# EasyEDA Pro project ProProject_Access Control USB Adapter_2024-06-07.epro

# Schematic V2.0.1 Schematic
Create Date: 2024-05-29; Page Name: Main Page; Project Name: Access Control USB Adapter; Schematic Name: V2.0.1 Schematic; Update Date: 2024-05-29; Company: RIT SHED MAKERSPACE; Drawn: Jim Heaney; Page Size: A4; Part Number: JLCPCB-002; Reviewed: Jim Heaney; Version: V0.1
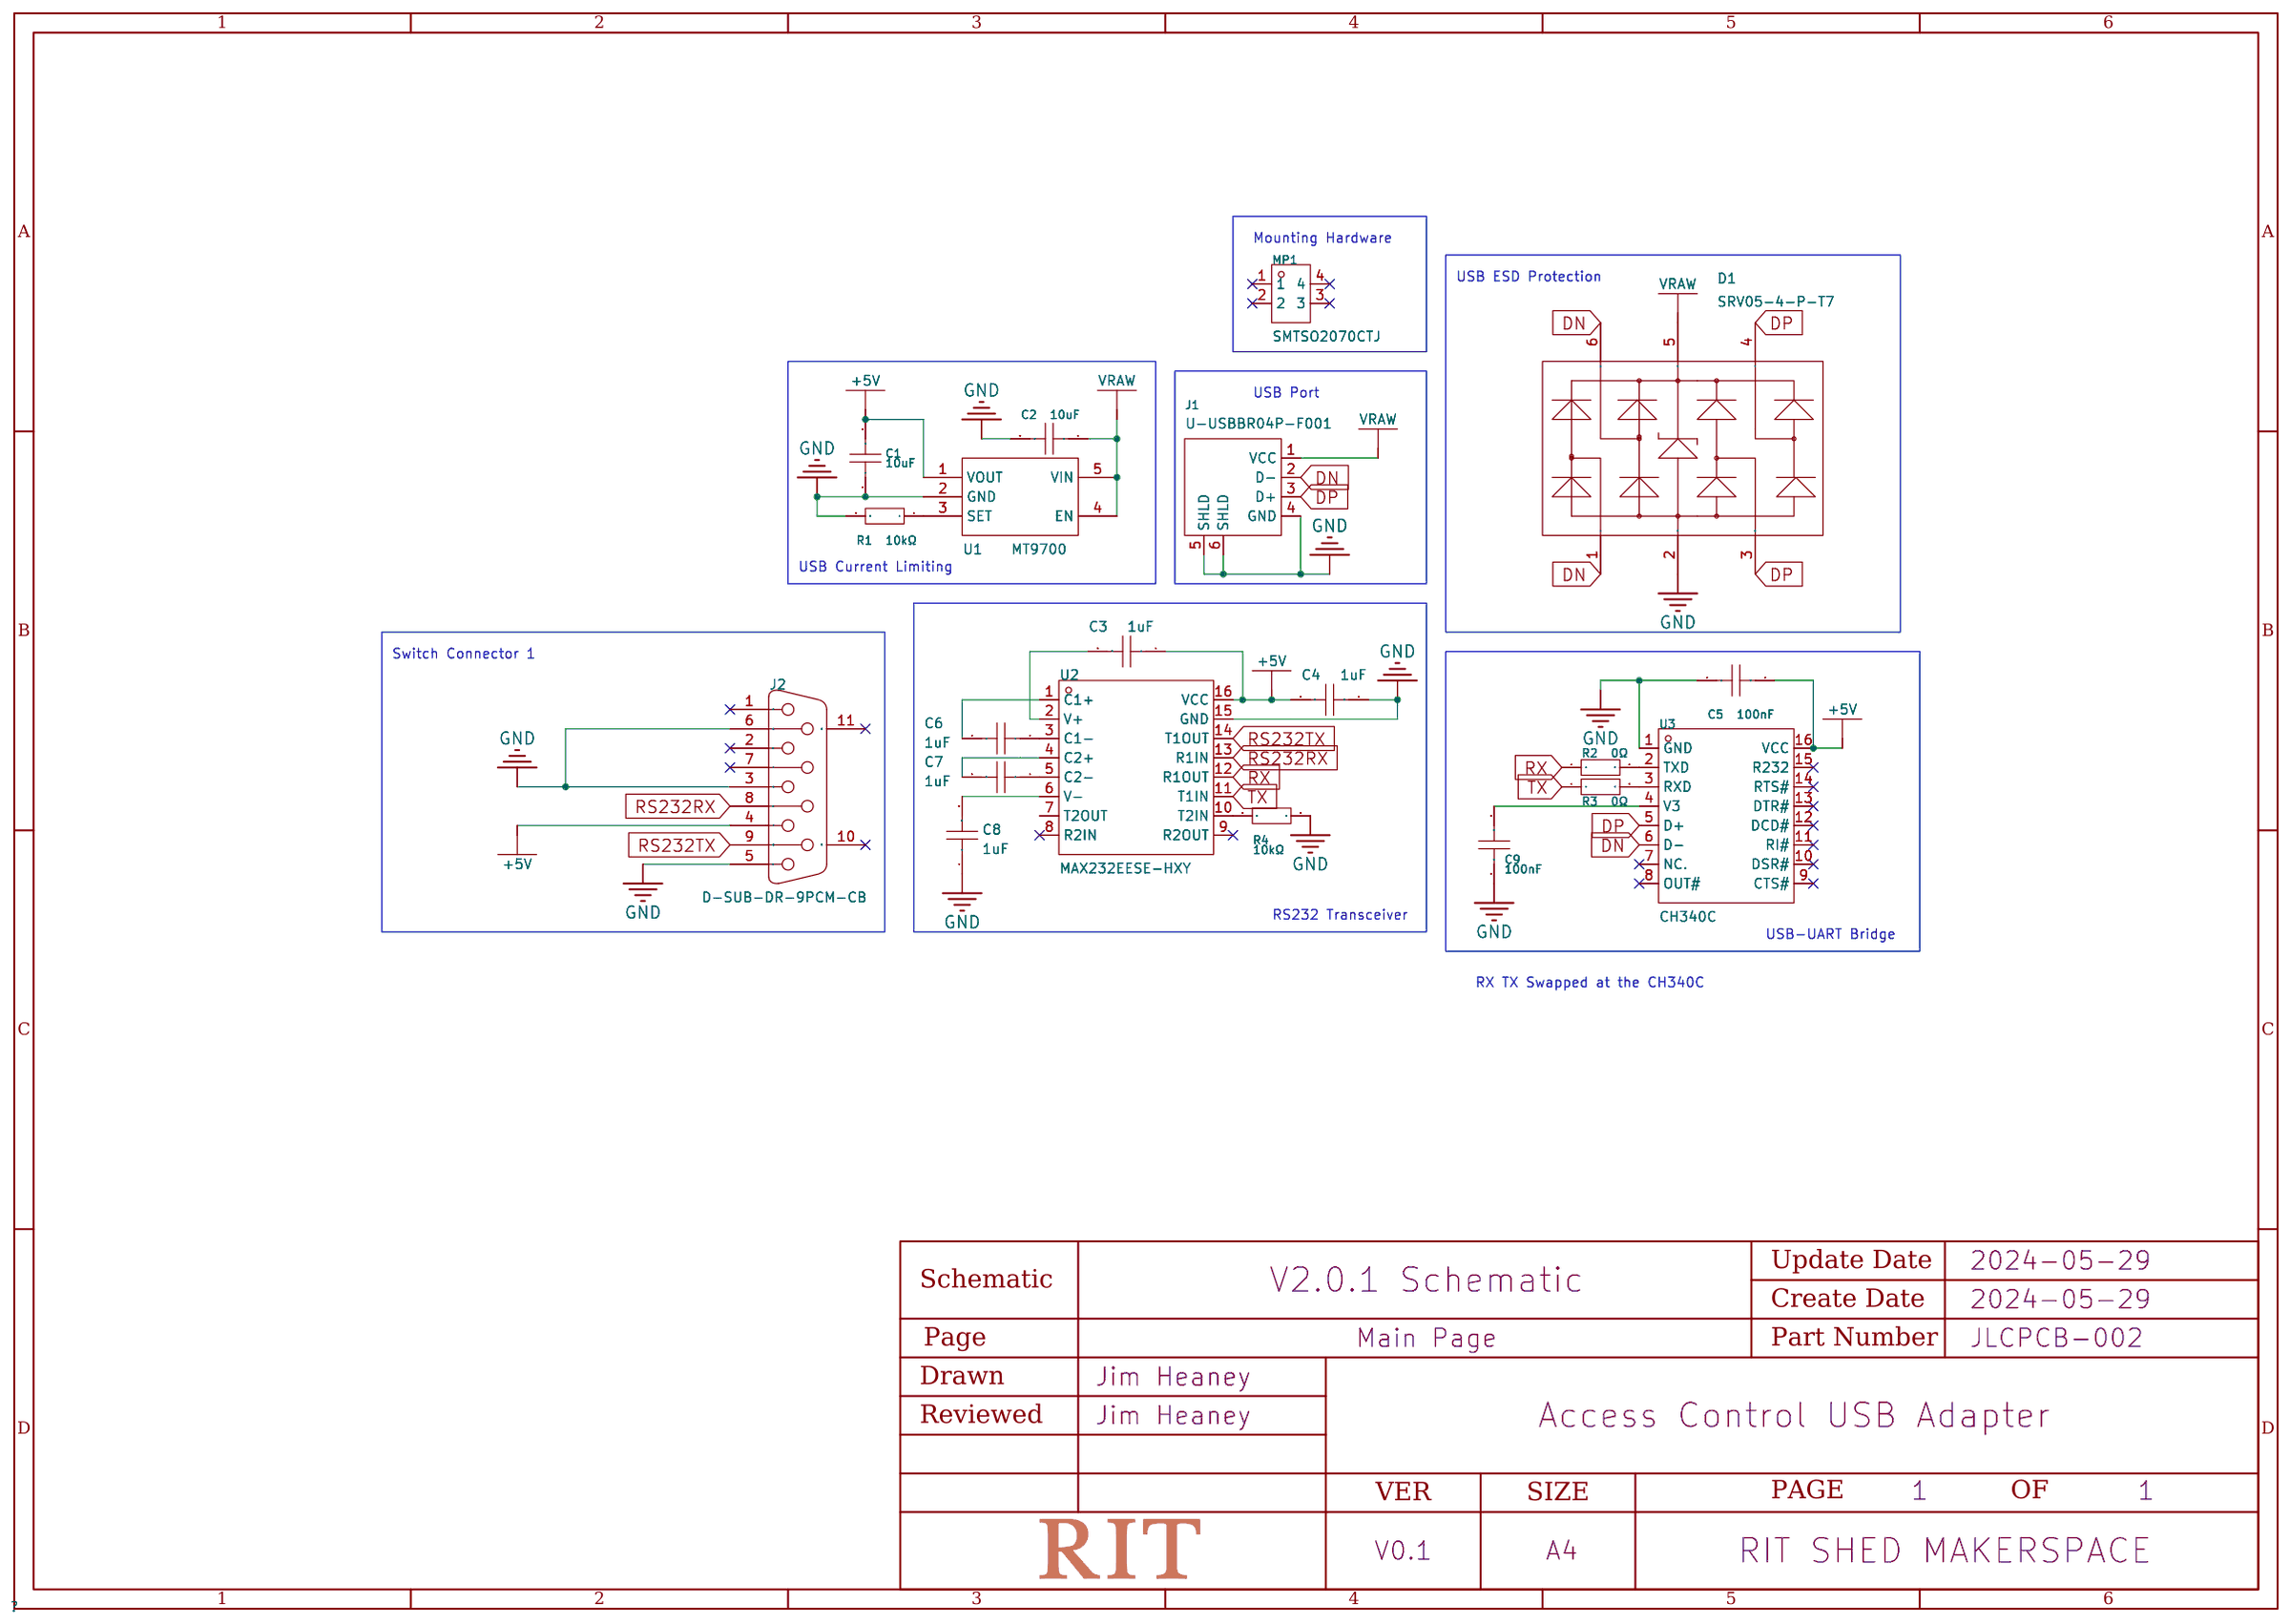
[diagram p0: schematic sheet]

## Parts
C1  10uF  [C0603]
C2  10uF  [C0603]
C3  1uF  [C0603]
C4  1uF  [C0603]
C5  100nF  [C0603]
C6  1uF  [C0603]
C7  1uF  [C0603]
C8  1uF  [C0603]
C9  100nF  [C0603]
D1  SRV05-4-P-T7  [SOT-23-6_L2.9-W1.6-P0.95-LS2.8-BR]
J1  U-USBBR04P-F001  [USB-B-TH_U241-041N-1BR85-1]
J2  D-SUB-DR-9PCM-CB  [DB9-TH_ID09S33E4GV00LF]
MP1  SMTSO2070CTJ  [SMD_BD5.6-L5.6-W5.6-D3.6]
R1  10kΩ  [R0603]
R2  0Ω  [R1206]
R3  0Ω  [R1206]
R4  10kΩ  [R0603]
U1  MT9700  [SOT-23-5_L3.0-W1.7-P0.95-LS2.8-BR]
U2  MAX232EESE-HXY  [SOP-16_L9.9-W3.9-P1.27-LS6.0-BL]
U3  CH340C  [SOP-16_L10.0-W3.9-P1.27-LS6.0-BL]

## Library data of the parts
C1 C2 = CL10A106MA8NRNC: Capacitance: Tolerance:±20% Tolerance:±20% Voltage Rated: Temperature Coefficient:; LCSC Part Name: 10uF ±20% 25V; Supplier Part: C96446; Manufacturer: SAMSUNG(三星); Supplier Footprint: 0603; JLCPCB Part Class: Basic Part; Datasheet: https://atta.szlcsc.com/upload/public/pdf/source/20160218/1457707763339.pdf; Supplier: LCSC; Tolerance: ±20%
C3 C4 C6-C8 = CL10A105KB8NNNC: Capacitance: Tolerance:±10% Tolerance:±10% Voltage Rated: Temperature Coefficient:; LCSC Part Name: 1uF ±10% 50V; Supplier Part: C15849; Manufacturer: SAMSUNG(三星); Supplier Footprint: 0603; JLCPCB Part Class: Basic Part; Datasheet: https://atta.szlcsc.com/upload/public/pdf/source/20160218/1457707763339.pdf; Supplier: LCSC; Tolerance: ±10%
C5 C9 = CC0603KRX7R9BB104: Capacitance: Tolerance:±10% Tolerance:±10% Voltage Rated: Temperature Coefficient:; LCSC Part Name: 100nF ±10% 50V; Supplier Part: C14663; Manufacturer: YAGEO(国巨); Supplier Footprint: 0603; JLCPCB Part Class: Basic Part; Datasheet: https://atta.szlcsc.com/upload/public/pdf/source/20180910/C282072_33301C7F631E79921B82A8DAC6BCC5B3.pdf; Supplier: LCSC; Tolerance: ±10%
D1 = SRV05-4-P-T7_C85364: Reverse Stand-Off Voltage (Vrwm):5V Breakdown Voltage:6V Peak Pulse Current (Ipp)@10/1000s:1A@8/20us Maximum Clamping Voltage:12V; LCSC Part Name: Vrwm:5V; Supplier Part: C85364; Manufacturer: PROTEK; Supplier Footprint: SOT-23-6; Datasheet: https://atta.szlcsc.com/upload/public/pdf/source/20161024/1477288764689.pdf; Supplier: LCSC; Reverse Stand-Off Voltage (Vrwm): 5V; Breakdown Voltage: 6V; Peak Pulse Current (Ipp)@10/1000μs: 1A@8/20us; Maximum Clamping Voltage: 12V
J1 = U-USBBR04P-F001: Connector Type:Type-B Standard:USB 2.0 Gender:Female Number of Ports:1 Number of Contacts:4P Mounting Style:Right-Angle Current Rating - Power (Max):1.5A Operating Temperature Range:- Operating Temperature Range:-; LCSC Part Name: Type-B 母 弯插; Supplier Part: C386743; Manufacturer: Ckmtw(灿科盟); Supplier Footprint: 插件; JLCPCB Part Class: Extended Part; Datasheet: https://atta.szlcsc.com/upload/public/pdf/source/20190509/C386743_2E7BDE199FB40B6F97679D15D491C286.pdf; Supplier: LCSC; Connector Type: Type-B; Standard: USB 2.0; Gender: Female; Number of Ports: 1; Number of Contacts: 4P; Mounting Style: Right-Angle; Current Rating - Power (Max): 1.5A
J2 = D-SUB-DR-9PCM-CB: Connector Type:D-Sub Gender:Female Number of Pins:9P Mounting Style:Right-Angle Number of Rows:2 Current Rating (Max):3A Contact Plating:Tin Operating Temperature Range:-50℃~+105℃ Operating Temperature Range:-50℃~+105℃; LCSC Part Name: D-Sub 母 P数:9P; Supplier Part: C19077337; Manufacturer: XUNPU(讯普); Supplier Footprint: 弯插; JLCPCB Part Class: Extended Part; Datasheet: https://atta.szlcsc.com/upload/public/pdf/source/20231108/FB2E8AB0BE4F620DDF3F7F4D0B9AFB97.pdf; Supplier: LCSC; Connector Type: D-Sub; Gender: Female; Number of Pins: 9P; Mounting Style: Right-Angle; Number of Rows: 2; Current Rating (Max): 3A; Contact Plating: Tin; Operating Temperature Range: -50℃~+105℃
MP1 = SMTSO2070CTJ: specifications:M2X7 surface treatment:镀锡 Product Description:- material quality:- model:SMTSO2070CTJ brand:Sinhoo(雄和远景); LCSC Part Name: 雄和远景，电路板表贴圆螺母柱，M2X7，铜镀锡,1个; Supplier Part: C2916355; Manufacturer: Sinhoo(雄和远景); JLCPCB Part Class: Extended Part; Datasheet: https://atta.szlcsc.com/upload/public/pdf/source/20211122/17CF5E24EB4D4DC090A80DE3D7DE5E21.pdf; Supplier: LCSC; specifications: M2X7; surface treatment: 镀锡; brand: Sinhoo(雄和远景)
R1 R4 = 0603WAF1002T5E: Type:Thick Film Resistors Resistance:10kΩ Tolerance:±1% Tolerance:±1% Power(Watts): Overload Voltage (Max): Temperature Coefficient:±100ppm/℃ Temperature Coefficient:±100ppm/℃ Operating Temperature Range:-55℃~+155℃ Operating Temperature Range:-55℃~+155℃; LCSC Part Name: 厚膜电阻 10kΩ ±1% 100mW; Supplier Part: C25804; Manufacturer: UNI-ROYAL(厚声); Supplier Footprint: 0603; JLCPCB Part Class: Basic Part; Datasheet: https://atta.szlcsc.com/upload/public/pdf/source/20200306/C422600_1E6D84923E4A46A82E41ADD87F860B5C.pdf; Supplier: LCSC; Type: Thick Film Resistors; Tolerance: ±1%; Temperature Coefficient: ±100ppm/℃; Operating Temperature Range: -55℃~+155℃
R2 R3 = 1206W4F0000T5E: Type:Thick Film Resistors Resistance: Tolerance:±1% Tolerance:±1% Power(Watts): Overload Voltage (Max): Temperature Coefficient:±800ppm/℃ Temperature Coefficient:±800ppm/℃ Operating Temperature Range:-55℃~+155℃ Operating Temperature Range:-55℃~+155℃; LCSC Part Name: 0Ω ±1% 250mW 厚膜电阻; Supplier Part: C17888; Manufacturer: UNI-ROYAL(厚声); Supplier Footprint: 1206; JLCPCB Part Class: Basic Part; Datasheet: https://atta.szlcsc.com/upload/public/pdf/source/20200306/C422600_1E6D84923E4A46A82E41ADD87F860B5C.pdf; Supplier: LCSC; Type: Thick Film Resistors; Tolerance: ±1%; Temperature Coefficient: ±800ppm/℃; Operating Temperature Range: -55℃~+155℃
U1 = MT9700: Supplier Part: C89855; Manufacturer: 西安航天民芯; Supplier Footprint: SOT-23-5; JLCPCB Part Class: Extended Part; Datasheet: https://atta.szlcsc.com/upload/public/pdf/source/20170418/1492481333031.pdf; Supplier: LCSC
U2 = MAX232EESE-HXY: Driver/receiver:2/2 Data Rate:120Kbps Data Rate:120Kbps Supply Voltage:5V Supply Voltage:5V; Supplier Part: C19626971; Manufacturer: HXY MOSFET(华轩阳电子); Supplier Footprint: SOP-16; JLCPCB Part Class: Extended Part; Datasheet: https://atta.szlcsc.com/upload/public/pdf/source/20231215/08C47B9710D348E23143C3CE5F7DFFF8.pdf; Supplier: LCSC; Driver/receiver: 2/2; Data Rate: 120Kbps; Supply Voltage: 5V
U3 = CH340C: Applications Function:Transceiver Protocol: Supply Voltage:3.3V；5V Supply Voltage:3.3V；5V Data Rate:2Mbps; LCSC Part Name: CH340C USB转串口芯片 CH340; Supplier Part: C84681; Manufacturer: WCH(南京沁恒); Supplier Footprint: SOP-16; JLCPCB Part Class: Extended Part; Datasheet: https://atta.szlcsc.com/upload/public/pdf/source/20200819/C84681_ADBED554CE321879DBD6B1D06488689C.pdf; Supplier: LCSC; Applications Function: Transceiver; Supply Voltage: 3.3V；5V; Data Rate: 2Mbps

## Nets
+5V: C1.2 C3.1 C4.2 C5.2 J2.4 U1.1(VOUT) U2.16(VCC) U3.16(VCC)
GND: C1.1 C2.2 C4.1 C5.1 C8.1 C9.1 D1.2 J1.4(GND) J1.5(SHLD) J1.6(SHLD) J2.3 J2.5 J2.6 R1.2 R4.1 U1.2(GND) U2.15(GND) U3.1(GND)
DN: D1.1 D1.6 J1.2(D-) U3.6(D-)
DP: D1.3 D1.4 J1.3(D+) U3.5(D+)
RS232RX: J2.8 U2.13(R1IN)
RS232TX: J2.9 U2.14(T1OUT)
RX: R2.1 U2.12(R1OUT)
TX: R3.1 U2.11(T1IN)
VRAW: C2.1 D1.5 J1.1(VCC) U1.4(EN) U1.5(VIN)
$1N403: C8.2 U2.6(V-)
$1N407: C7.1 U2.5(C2-)
$1N409: C3.2 U2.2(V+)
$1N413: C7.2 U2.4(C2+)
$1N417: C6.1 U2.3(C1-)
$1N419: C6.2 U2.1(C1+)
$1N493: R4.2 U2.10(T2IN)
$1N971: R1.1 U1.3(SET)
$1N1382: C9.2 U3.4(V3)
$1N1839: R2.2 U3.2(TXD)
$1N1841: R3.2 U3.3(RXD)

Not connected (* = marked no-connect by the designer): J2 1* 2* 7* 10(MH1)* 11(MH2)*; MP1 1* 2* 3* 4*; U2 7(T2OUT) 8(R2IN)* 9(R2OUT)*; U3 7(NC.)* 8(OUT#)* 9(CTS#)* 10(DSR#)* 11(RI#)* 12(DCD#)* 13(DTR#)* 14(RTS#)* 15(R232)*

## Notes on the sheet
- Mounting Hardware
- USB ESD Protection
- USB Port
- USB Current Limiting
- Switch Connector 1
- RS232 Transceiver
- USB-UART Bridge
- RX TX Swapped at the CH340C

# Board V2.0.1 PCB
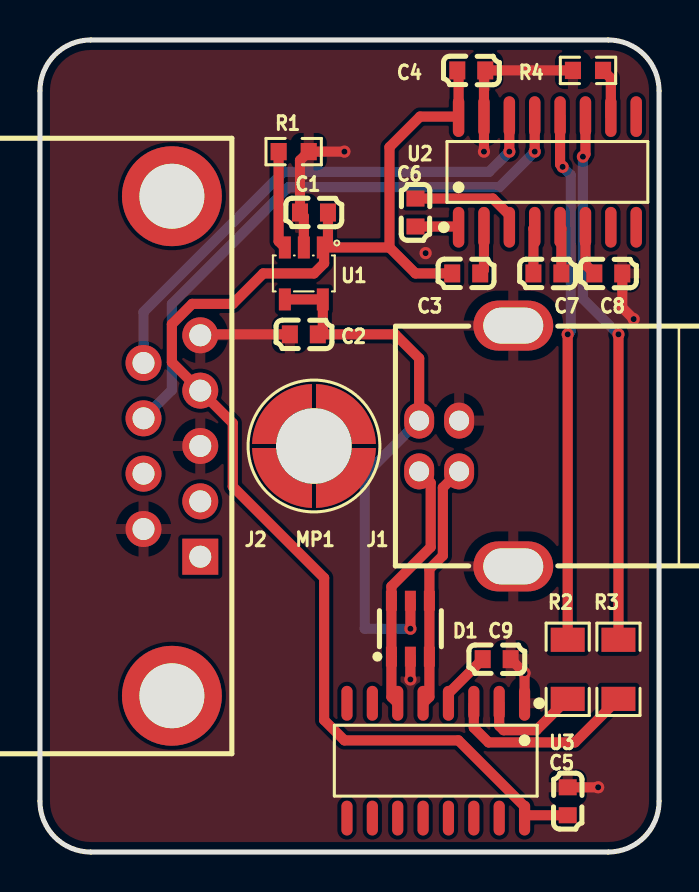
[diagram p1: board, top side]
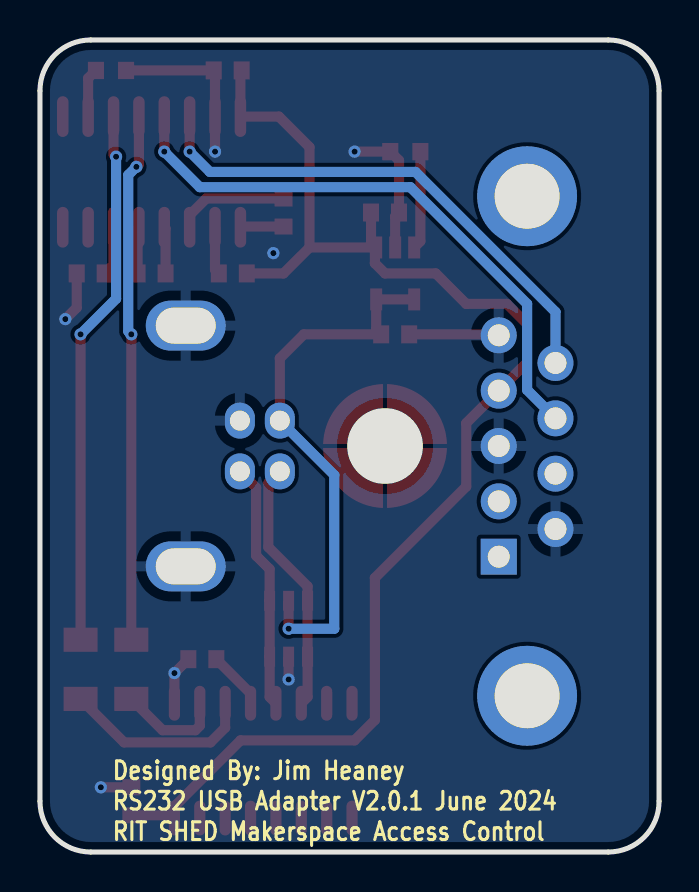
[diagram p2: board, bottom side, seen from below]

Outline 30.99 x 40.64 mm; copper layers: Top Layer, Bottom Layer. Coordinates in mm from the lower left corner of the outline.
Outline path: 0,38.1 0,2.54 arc(0.74,0.74) 2.54,0 28.45,0 arc(30.24,0.74) 30.99,2.54 30.99,38.1 arc(30.24,39.9) 28.45,40.64 2.54,40.64 arc(0.74,39.9) 0,38.1
Stack: Top Layer 0.035mm / Dielectric1 1.51mm FR4 er 4.5 / Bottom Layer 0.035mm

## Design rules (mm)
template: JLCPCB Capability(Two Layers Board)
spacing copperThickness1oz (default): track to track 0.102, other pairs 0.152 to 0.3
spacing copperThickness2oz: track to track 0.203, other pairs 0.152 to 0.3
track width copperThickness1oz (default): min 0.127, default 0.254, max 2.54
track width copperThickness2oz: min 0.203, default 0.254, max 2.54
differential pair differentialPair (default): width min 0.127, default 0.254, max 2.54; gap min 0.152, default 0.152
via viaSize (default): diameter min 0.5, default 0.61, max 10; hole min 0.3, default 0.305, max 6.3

## Placement (name value [footprint] x y rotation side)
C1  10uF  [C0603]  13.72 32 0 top
C2  10uF  [C0603]  13.21 25.91 180 top
C3  1uF  [C0603]  21.34 28.96 0 top
C4  1uF  [C0603]  21.59 39.12 180 top
C5  100nF  [C0603]  26.42 2.54 270 top
C6  1uF  [C0603]  18.8 32 270 top
C7  1uF  [C0603]  25.4 28.96 180 top
C8  1uF  [C0603]  28.45 28.96 180 top
C9  100nF  [C0603]  22.86 9.65 180 top
D1  SRV05-4-P-T7  [SOT-23-6_L2.9-W1.6-P0.95-LS2.8-BR]  18.54 11.18 270 top
J1  U-USBBR04P-F001  [USB-B-TH_U241-041N-1BR85-1]  21.34 20.32 90 top
J2  D-SUB-DR-9PCM-CB  [DB9-TH_ID09S33E4GV00LF]  6.6 20.32 270 top
MP1  SMTSO2070CTJ  [SMD_BD5.6-L5.6-W5.6-D3.6]  13.72 20.32 0 top
R1  10kΩ  [R0603]  12.7 35.05 0 top
R2  0Ω  [R1206]  26.42 9.14 270 top
R3  0Ω  [R1206]  28.96 9.14 270 top
R4  10kΩ  [R0603]  27.43 39.12 0 top
U1  MT9700  [SOT-23-5_L3.0-W1.7-P0.95-LS2.8-BR]  13.21 28.96 90 top
U2  MAX232EESE-HXY  [SOP-16_L9.9-W3.9-P1.27-LS6.0-BL]  25.4 34.04 0 top
U3  CH340C  [SOP-16_L10.0-W3.9-P1.27-LS6.0-BL]  19.81 4.57 180 top

## Footprints (pads in the part's own frame, mm; a bottom-side part is the same pattern mirrored in y, then rotated)
C0603
  rect 0.8x0.9 smd: 1(-0.7,0) 2(0.7,0)
DB9-TH_ID09S33E4GV00LF
  rect 1.8x1.8 hole 1.1: 1(5.54,1.42)
  round 1.8 hole 1.1: 2(2.77,1.42) 3(0,1.42) 4(-2.77,1.42) 5(-5.54,1.42) 6(4.155,-1.42) 7(1.385,-1.42) 8(-1.385,-1.42) 9(-4.155,-1.42)
  round 5 hole 3.25: 10(-12.5,0) 11(12.5,0)
R0603
  rect 0.806x0.864 smd: 1(-0.753,0) 2(0.753,0)
R1206
  rect 1.208x1.701 smd: 1(-1.479,0) 2(1.479,0)
SMD_BD5.6-L5.6-W5.6-D3.6
  custom 3x3 smd: 1(-1.844,1.6) 1(-1.601,-1.844) 1(1.6,1.844) 1(1.844,-1.6)
SOP-16_L9.9-W3.9-P1.27-LS6.0-BL
  oval 0.574x2.038 smd: 1(-4.445,-2.769) 2(-3.175,-2.769) 3(-1.905,-2.769) 4(-0.635,-2.769) 5(0.635,-2.769) 6(1.905,-2.769) 7(3.175,-2.769) 8(4.445,-2.769) 9(4.445,2.769) 10(3.175,2.769) 11(1.905,2.769) 12(0.635,2.769) 13(-0.635,2.769) 14(-1.905,2.769) 15(-3.175,2.769) 16(-4.445,2.769)
SOP-16_L10.0-W3.9-P1.27-LS6.0-BL
  oval 0.56x1.745 smd: 1(-4.445,-2.873) 2(-3.175,-2.873) 3(-1.905,-2.873) 4(-0.635,-2.873) 5(0.635,-2.873) 6(1.905,-2.873) 7(3.175,-2.873) 8(4.445,-2.873) 9(4.445,2.873) 10(3.175,2.873) 11(1.905,2.873) 12(0.635,2.873) 13(-0.635,2.873) 14(-1.905,2.873) 15(-3.175,2.873) 16(-4.445,2.873)
SOT-23-5_L3.0-W1.7-P0.95-LS2.8-BR
  rect 1.1x0.6 smd: 1(1.3,-0.95) 2(1.3,0) 3(1.3,0.95) 4(-1.3,0.95) 5(-1.3,-0.95)
SOT-23-6_L2.9-W1.6-P0.95-LS2.8-BR
  rect 1x0.55 smd: 1(1.4,-0.95) 2(1.4,0) 3(1.4,0.95) 4(-1.4,0.95) 5(-1.4,0) 6(-1.4,-0.95)
USB-B-TH_U241-041N-1BR85-1
  oval 1.8x1.5 hole 1: 1(1.27,2.355) 2(-1.27,2.355) 3(-1.27,0.355) 4(1.27,0.355)
  oval 2.5x4 hole 1.8x3: 5(6.025,-2.355) 6(-6.025,-2.355)

## Nets
As in the schematic.

Pads without a net: J2 1 2 7 10 11; MP1 1; U2 7 8 9; U3 7 8 9 10 11 12 13 14 15

## Via types
v1: diameter 0.61, hole 0.305, Top Layer to Bottom Layer, 14 vias

## Routing (per net, layer and track width the routed paths; a pad name or vN(x,y) marks a point on that pad's centre or on a via; arc(x,y) is an arc through that point)
+5V: length 67.6
  Top Layer w0.508: U1.1 14.22,30.19 14.22,29.46 13.72,28.96 11.18,28.96 9.65,27.43 7.62,27.43 6.6,26.42 6.6,24.51 J2.4 9.65,21.46 9.65,18.29 14.22,13.72 14.22,6.6 15.24,5.59 20.95,5.59 24.26,2.28 U3.16 24.4,1.84 C5.2 ; U1.1 17.5,30.26 ; U1.1 14.42,30.51 C1.2 ; C4.2 20.95,39.05 20.95,36.8 19.02,36.8 17.5,35.28 17.5,30.26 ; 17.5,30.26 18.8,28.96 C3.1
GND: length 27.5
  Top Layer w0.508: C2.2 8.07,25.91 J2.5 ; C9.1 v1(24.26,8.95) U3.1 ; R4.1 C4.1 22.22,39.05 v1(22.22,35.05) ; C5.1 v1(27.94,3.24) ; v1(29.72,26.67) 29.15,27.24 C8.1 ; v1(15.24,35.05) R1.2 13.02,34.61 C1.1 13.21,31.81 U1.2 ; v1(18.54,8.64) D1.2
  vias: v1(19.3,29.97)
DN: length 12.8
  Top Layer w0.508: U3.6 17.59,7.76 D1.1 D1.6 17.59,13.29 19.56,15.26 19.56,18.47 J1.2
DP: length 12.4
  Top Layer w0.508: U3.5 19.49,7.76 D1.3 D1.4 19.49,14.16 20.17,14.83 20.17,18.24 J1.3
RS232RX: length 28.8
  Top Layer w0.508: 24.76,36.8 v1(24.76,35.05)
  Bottom Layer w0.508: 5.62,22.14 6.6,23.12 6.6,27.43 12.45,33.27 22.99,33.27 v1(24.76,35.05)
RS232TX: length 25.9
  Top Layer w0.508: 23.5,36.8 v1(23.5,35.05)
  Bottom Layer w0.508: v1(23.5,35.05) 22.48,34.04 12.19,34.04 5.18,27.03 J2.9
RX: length 26.5
  Top Layer w0.508: v1(26.16,34.29) 26.03,34.42 26.03,36.8 ; R2.1 v1(26.42,25.91)
  Bottom Layer w0.508: v1(26.42,25.91) 26.57,26.06 26.57,33.88 v1(26.16,34.29)
TX: length 27
  Top Layer w0.508: 27.3,36.8 27.3,34.92 v1(27.18,34.8) ; R3.1 v1(28.96,25.91)
  Bottom Layer w0.508: v1(27.18,34.8) 27.18,27.69 v1(28.96,25.91)
VRAW: length 27.7
  Top Layer w0.508: U1.4 U1.5 14.16,26.16 C2.1 17.78,25.91 18.98,24.71 J1.1 ; D1.5 v1(18.54,11.18)
  Bottom Layer w0.508: J1.1 16.26,18.86 16.26,11.18 v1(18.54,11.18)
$1N403: length 2.5
  Top Layer w0.508: U2.6 27.3,29.4 C8.2
$1N407: length 2.3
  Top Layer w0.508: 26.03,31.27 26.1,31.2 C7.1
$1N409: length 2.4
  Top Layer w0.508: U2.2 22.22,29.14 C3.2
$1N413: length 2.3
  Top Layer w0.508: C7.2 24.7,31.2 U2.4
$1N417: length 5.7
  Top Layer w0.508: U2.3 23.5,31.88 22.67,32.7 C6.1
$1N419: length 2.2
  Top Layer w0.508: U2.1 20.92,31.3 C6.2
$1N493: length 2.5
  Top Layer w0.508: 28.57,36.8 28.57,38.73 R4.2
$1N971: length 4.9
  Top Layer w0.508: U1.3 11.95,30.57 R1.1
$1N1382: length 2.9
  Top Layer w0.508: C9.2 20.45,7.94 20.45,7.44
$1N1839: length 5.3
  Top Layer w0.508: U3.2 22.99,6.32 23.21,6.1 24.85,6.1 R2.2
$1N1841: length 9.7
  Top Layer w0.508: R3.2 26.78,5.49 22.45,5.49 21.72,6.22 U3.3

## Copper pours and planes (outline as drawn; the poured copper is in the pictures)
GND on Top Layer: -0.51,44.2 32,44.2 32,-4.57 -0.51,-4.57
GND on Bottom Layer: -6.6,41.15 37.59,41.15 37.59,-0.51 -6.6,-0.51

## Text on the board
Bottom Silkscreen Layer: Designed By: Jim Heaney | RS232 USB Adapter V2.0.1 June 2024 | RIT SHED Makerspace Access Control
